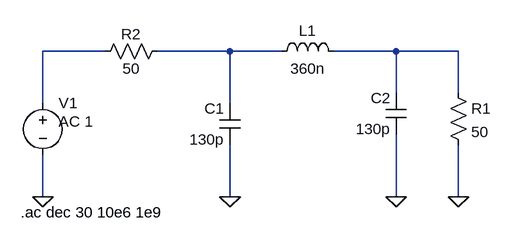
[diagram p0: schematic input_reconstruction_filter.asc]
input_reconstruction_filter.asc, the LTspice schematic file:
Version 4
SHEET 1 880 680
WIRE 0 48 -96 48
WIRE 192 48 80 48
WIRE 272 48 192 48
WIRE 448 48 352 48
WIRE 544 48 448 48
WIRE 448 112 448 48
WIRE 544 112 544 48
WIRE -96 128 -96 48
WIRE 192 128 192 48
WIRE -96 272 -96 208
WIRE 192 272 192 192
WIRE 448 272 448 176
WIRE 544 272 544 192
FLAG -96 272 0
FLAG 544 272 0
FLAG 448 272 0
FLAG 192 272 0
SYMBOL voltage -96 112 R0
WINDOW 3 24 44 Left 2
WINDOW 123 0 0 Left 0
WINDOW 39 0 0 Left 0
SYMATTR InstName V1
SYMATTR Value AC 1
SYMBOL cap 208 192 R180
WINDOW 0 24 56 Left 2
WINDOW 3 24 8 Left 2
SYMATTR InstName C1
SYMATTR Value 130p
SYMBOL cap 464 176 R180
WINDOW 0 24 56 Left 2
WINDOW 3 24 8 Left 2
SYMATTR InstName C2
SYMATTR Value 130p
SYMBOL ind 256 64 R270
WINDOW 0 32 56 VTop 2
WINDOW 3 5 56 VBottom 2
SYMATTR InstName L1
SYMATTR Value 360n
SYMBOL res 528 96 R0
SYMATTR InstName R1
SYMATTR Value 50
SYMBOL res 96 32 R90
WINDOW 0 5 56 VBottom 2
WINDOW 3 27 56 VTop 2
SYMATTR InstName R2
SYMATTR Value 50
TEXT -130 296 Left 2 !.ac dec 30 10e6 1e9

The netlist it stands for:
* input_reconstruction_filter.asc
V1 N001 0 AC 1
C1 0 N002 130p
C2 0 N003 130p
L1 N002 N003 360n
R1 N003 0 50
R2 N002 N001 50
.ac dec 30 10e6 1e9
.backanno
.end